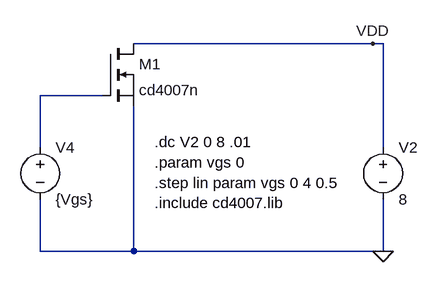
[diagram p0: schematic Draft13.asc]
Draft13.asc, the LTspice schematic file:
Version 4
SHEET 1 880 680
WIRE 528 160 160 160
WIRE 544 160 528 160
WIRE 112 240 16 240
WIRE 16 320 16 240
WIRE 544 320 544 160
WIRE 16 480 16 400
WIRE 160 480 160 256
WIRE 160 480 16 480
WIRE 544 480 544 400
WIRE 544 480 160 480
FLAG 544 480 0
FLAG 528 160 VDD
SYMBOL voltage 16 304 R0
SYMATTR InstName V4
SYMATTR Value {Vgs}
SYMBOL nmos 112 160 R0
SYMATTR InstName M1
SYMATTR Value cd4007n
SYMBOL voltage 544 304 R0
SYMATTR InstName V2
SYMATTR Value 8
TEXT 192 312 Left 2 !.dc V2 0 8 .01\n.param vgs 0\n.step lin param vgs 0 4 0.5\n.include cd4007.lib

The netlist it stands for:
* Draft13.asc
V4 N001 0 {Vgs}
M1 VDD N001 0 0 cd4007n
V2 VDD 0 8
.model NMOS NMOS
.model PMOS PMOS
.lib standard.mos
.dc V2 0 8 .01
.param vgs 0
.step lin param vgs 0 4 0.5
.include cd4007.lib
.backanno
.end